# EAGLE design respirho2pile (EAGLE 9.6.2)
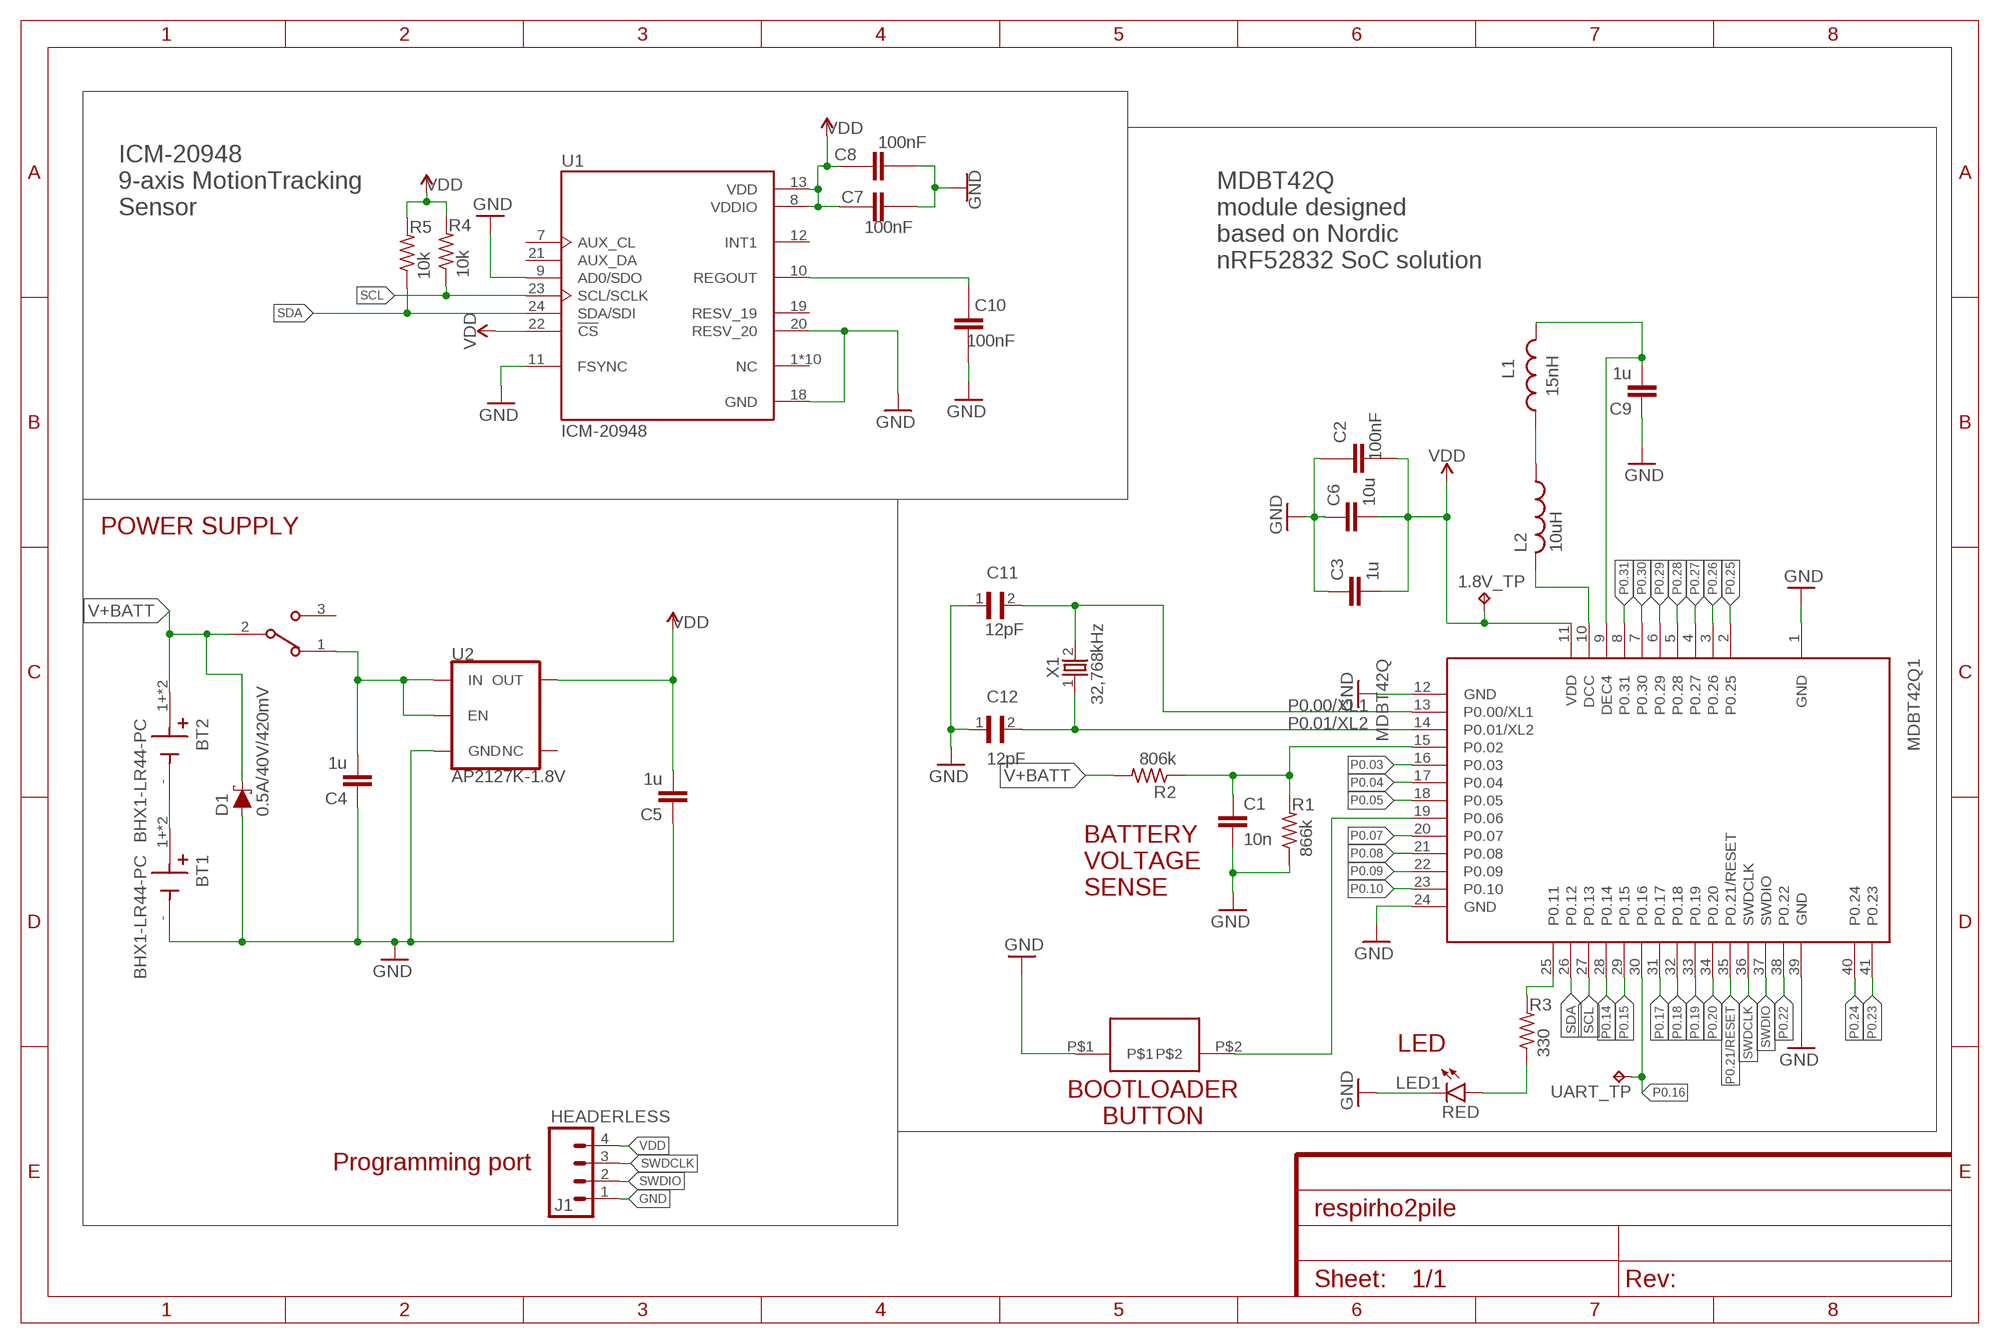
[diagram p0: schematic, sheet 1]

## Parts
1.8V_TP  TPB1,27  [B1,27]
BT1  BHX1-LR44-PC  [BAT_BHX1-LR44-PC]
BT2  BHX1-LR44-PC  [BAT_BHX1-LR44-PC]
C1  10n  C-EUC0603  [C0603]
C2  100nF  CC0402KRX7R6BB104  [CAPC1005X60]
C3  1u  C-EUC0603  [C0603]
C4  1u  C-EUC0603  [C0603]
C5  1u  C-EUC0603  [C0603]
C6  10u  C-EUC2012  [C2012]
C7  100nF  CC0402KRX7R6BB104  [CAPC1005X60]
C8  100nF  CC0402KRX7R6BB104  [CAPC1005X60]
C9  1u  C-EUC0603  [C0603]
C10  100nF  CC0402KRX7R6BB104  [CAPC1005X60]
C11  12pF  04025A120GAT2A  [CAPC1005X56N]
C12  12pF  04025A120GAT2A  [CAPC1005X56N]
D1  0.5A/40V/420mV  DIODE-SCHOTTKY-PMEG4005EJ  [SOD-323]
J1  HEADERLESS  CONN_04PTH  [1X04]
L1  15nH  LQG15HS15NJ02D  [INDC1005X55N]
L2  10uH  INDUCTOR_0603_L  [RESC0603_L]
LED1  RED  LEDCHIPLED_1206  [CHIPLED_1206]
MDBT42Q1  MDBT42Q  [MDBT42Q]
R1  866k  R-US_R0402  [R0402]
R2  806k  R-US_R0402  [R0402]
R3  330  R-US_R0402  [R0402]
R4  10k  R-US_R0402  [R0402]
R5  10k  R-US_R0402  [R0402]
SW1  EG1213  [SW_EG1213]
SW2  KSS231GLFS  [KSS231GLFS]
U1  ICM-20948  [QFN40P300X300X105-24N]
U2  AP2127K-1.8V  TPS7A0518PDBVTK-1.8V  [SOT23-5]
UART_TP  TPB1,27  [B1,27]
X1  32,768kHz  XTAL_32KHZ  [XTAL_3215_N]

## Nets
GND: BT1.- C1.2 C2.2 C3.1 C4.1 C5.1 C6.1 C7.1 C8.1 C9.1 C10.1 C11.1 C12.1 D1.A J1.1 LED1.C MDBT42Q1.1(GND) MDBT42Q1.12(GND) MDBT42Q1.24(GND) MDBT42Q1.39(GND) R1.1 SW2.P$1 U1.9(AD0/SDO) U1.11(FSYNC) U1.18(GND) U1.20(RESV_20) U2.2(GND)
N$1: LED1.A R3.1
N$2: L2.2 MDBT42Q1.10(DCC)
N$3: L1.1 L2.1
N$4: C9.2 L1.2 MDBT42Q1.9(DEC4)
N$5: MDBT42Q1.25(P0.11) R3.2
N$6: BT1.1+(+) BT1.2+(+) BT2.-
N$7: C10.2 U1.10(REGOUT)
N$8: C4.2 SW1.1 U2.1(IN) U2.3(EN)
N$9: C1.1 MDBT42Q1.15(P0.02) R1.2 R2.1
P0.00/XL1: C11.2 MDBT42Q1.13(P0.00/XL1) X1.2
P0.01/XL2: C12.2 MDBT42Q1.14(P0.01/XL2) X1.1
P0.03: MDBT42Q1.16(P0.03)
P0.04: MDBT42Q1.17(P0.04)
P0.05: MDBT42Q1.18(P0.05)
P0.07: MDBT42Q1.20(P0.07)
P0.08: MDBT42Q1.21(P0.08)
P0.09: MDBT42Q1.22(P0.09)
P0.10: MDBT42Q1.23(P0.10)
P0.14: MDBT42Q1.28(P0.14)
P0.15: MDBT42Q1.29(P0.15)
P0.16: MDBT42Q1.30(P0.16) UART_TP.TP
P0.17: MDBT42Q1.31(P0.17)
P0.18: MDBT42Q1.32(P0.18)
P0.19: MDBT42Q1.33(P0.19)
P0.20: MDBT42Q1.34(P0.20)
P0.21/RESET: MDBT42Q1.35(P0.21/RESET)
P0.22: MDBT42Q1.38(P0.22)
P0.23: MDBT42Q1.41(P0.23)
P0.24: MDBT42Q1.40(P0.24)
P0.25: MDBT42Q1.2(P0.25)
P0.26: MDBT42Q1.3(P0.26)
P0.27: MDBT42Q1.4(P0.27)
P0.28: MDBT42Q1.5(P0.28)
P0.29: MDBT42Q1.6(P0.29)
P0.30: MDBT42Q1.7(P0.30)
P0.31: MDBT42Q1.8(P0.31)
P06: MDBT42Q1.19(P0.06) SW2.P$2
SCL: MDBT42Q1.27(P0.13) R4.1 U1.23(SCL/SCLK)
SDA: MDBT42Q1.26(P0.12) R5.1 U1.24(SDA/SDI)
SWDCLK: J1.3 MDBT42Q1.36(SWDCLK)
SWDIO: J1.2 MDBT42Q1.37(SWDIO)
V+BATT: BT2.1+(+) BT2.2+(+) D1.C R2.2 SW1.2
VDD: 1.8V_TP.TP C2.1 C3.2 C5.2 C6.2 C7.2 C8.2 J1.4 MDBT42Q1.11(VDD) R4.2 R5.2 U1.8(VDDIO) U1.13(VDD) U1.22(!CS) U2.5(OUT)
Unconnected: SW1.3 U1.1(NC) U1.2(NC) U1.3(NC) U1.4(NC) U1.5(NC) U1.6(NC) U1.7(AUX_CL) U1.12(INT1) U1.14(NC) U1.15(NC) U1.16(NC) U1.17(NC) U1.19(RESV_19) U1.21(AUX_DA) U2.4(NC)

## Notes on the sheet
- ICM-20948
  9-axis MotionTracking
  Sensor
- MDBT42Q
  module designed 
  based on Nordic 
  nRF52832 SoC solution
- POWER SUPPLY
- BATTERY
  VOLTAGE
  SENSE
- LED
- BOOTLOADER
  BUTTON
- Programming port

## Library data of the parts
1.8V_TP UART_TP = testpad:TP: Test pad
BT1 BT2 = BHX1-LR44-PC:BHX1-LR44-PC: Battery Retainer Coin, 12.0mm 1 Cell PC Pin; DESCRIPTION: Battery Retainer Coin, 12.0mm 1 Cell PC Pin; DIGI-KEY_PART_NUMBER: BHX1-LR44-PC-G-ND; MF: MPD; MP: BHX1-LR44-PC; PACKAGE: None; PURCHASE-URL: https://pricing.snapeda.com/search/part/BHX1-LR44-PC/?ref=eda
C1 C3-C6 C9 = rcl:C-EU: CAPACITOR, European symbol; SPICEPREFIX: C
C2 C7 C8 C10 = CC0402KRX7R6BB104:CC0402KRX7R6BB104: Capacitor 100nF 10V 0402 SMD X7R (reel); DESCRIPTION: 0.1µF ±10% 10V Ceramic Capacitor X7R 0402 _1005 Metric_; DIGI-KEY_PART_NUMBER: 311-1345-1-ND; DIGI-KEY_PURCHASE_URL: https://www.digikey.com/product-detail/en/yageo/CC0402KRX7R6BB104/311-1345-1-ND/2103129?utm_source=snapeda&utm_medium=aggregator&utm_campaign=symbol; MF: Yageo; MP: CC0402KRX7R6BB104; PACKAGE: 0402 Yageo
C11 C12 = 04025A120GAT2A:04025A120GAT2A: CAP, MLCC, C0G, 12PF, 50V, 0402; DESCRIPTION: 0402 12 pF 50 V ±2% Tolerance C0G/NP0 SMT Multilayer Ceramic Capacitor; DIGI-KEY_PART_NUMBER: 478-7871-1-ND; DIGI-KEY_PURCHASE_URL: https://www.digikey.com/product-detail/en/avx-corporation/04025A120GAT2A/478-7871-1-ND/3881494?utm_source=snapeda&utm_medium=aggregator&utm_campaign=symbol; MF: AVX; MP: 04025A120GAT2A; PACKAGE: 1005 AVX
D1 = SparkFun-DiscreteSemi:DIODE-SCHOTTKY: Schottky diode A Schottky diode is a semiconductor diode which has a low forward voltage drop and a very fast switching action.; PROD_ID: DIO-10955
J1 = SparkFun-Connectors:CONN_04: Multi connection point. Often used as Generic Header-pin footprint for 0.1 inch spaced/style header connections On any of the 0.1 inch spaced packages, you can populate with these: Break Away Headers - Straight <https://www.sparkfun.com/products/116> (PRT-00116) Break Away Male Headers - Right Angle <https://www.sparkfun.com/products/553> (PRT-00553) Female Headers <https://www.sparkfun.com/products/115> (PRT-00115) Break Away Headers - Machine Pin <https://www.sparkfun.com/products/117> (PRT-00117) Break Away Female Headers - Swiss Machine Pin <https://www.sparkfun.com/products/743> (PRT-00743) For SCREWTERMINALS and SPRING TERMINALS visit here: Screw Terimnals on SparkFun.com <https://www.sparkfun.com/search/results?term=Screw+Terminals> (5mm/3.5mm/2.54mm spacing) This device is also useful as a general connection point to wire up your design to another part of your project. Our various solder wires solder well into these plated through hole pads. Hook-Up Wire - Assortment (Stranded, 22 AWG) <https://www.sparkfun.com/products/11375> (PRT-11375) Hook-Up Wire - Assortment (Solid Core, 22 AWG) <https://www.sparkfun.com/products/11367> (PRT-11367) View the entire wire category on our website here <https://www.sparkfun.com/categories/141> Special notes: Molex polarized connector foot print use with SKU : PRT-08231 with associated crimp pins and housings. 1MM SMD Version SKU: PRT-10208; PROD_ID: CONN-09696
L1 = LQG15HS15NJ02D:LQG15HS15NJ02D: Ind RF Chip Multi-Layer 15nH 5% 100MHz 8Q-Factor Air 300mA 0402 Paper T/R; DESCRIPTION: Inductor with Inductance: 15nH Tol. +/-5%, Package: 0402 _1005_; DIGI-KEY_PART_NUMBER: 490-2625-1-ND; DIGI-KEY_PURCHASE_URL: https://www.digikey.com/product-detail/en/murata-electronics/LQG15HS15NJ02D/490-2625-1-ND/662905?utm_source=snapeda&utm_medium=aggregator&utm_campaign=symbol; MF: Murata Electronics; MP: LQG15HS15NJ02D; PACKAGE: 1005 Murata
L2 = Nordic_nRF:INDUCTOR: Generic chip inductor
LED1 = led:LED: LED OSRAM: - CHIPLED LG R971, LG N971, LY N971, LG Q971, LY Q971, LO R971, LY R971 LH N974, LH R974 LS Q976, LO Q976, LY Q976 LO Q996 - Hyper CHIPLED LW Q18S LB Q993, LB Q99A, LB R99A - SideLED LS A670, LO A670, LY A670, LG A670, LP A670 LB A673, LV A673, LT A673, LW A673 LH A674 LY A675 LS A676, LA A676, LO A676, LY A676, LW A676 LS A679, LY A679, LG A679 - Hyper Micro SIDELED® LS Y876, LA Y876, LO Y876, LY Y876 LT Y87S - SmartLED LW L88C, LW L88S LB L89C, LB L89S, LG L890 LS L89K, LO L89K, LY L89K LS L896, LA L896, LO L896, LY L896 - TOPLED LS T670, LO T670, LY T670, LG T670, LP T670 LSG T670, LSP T670, LSY T670, LOP T670, LYG T670 LG T671, LOG T671, LSG T671 LB T673, LV T673, LT T673, LW T673 LH T674 LS T676, LA T676, LO T676, LY T676, LB T676, LH T676, LSB T676, LW T676 LB T67C, LV T67C, LT T67C, LS T67K, LO T67K, LY T67K, LW E67C LS E67B, LA E67B, LO E67B, LY E67B, LB E67C, LV E67C, LT E67C LW T67C LS T679, LY T679, LG T679 LS T770, LO T770, LY T770, LG T770, LP T770 LB T773, LV T773, LT T773, LW T773 LH T774 LS E675, LA E675, LY E675, LS T675 LS T776, LA T776, LO T776, LY T776, LB T776 LHGB T686 LT T68C, LB T68C - Hyper Mini TOPLED® LB M676 - Mini TOPLED Santana® LG M470 LS M47K, LO M47K, LY M47K Source: http://www.osram.convergy.de LUXEON: - LUMILED® LXK2-PW12-R00, LXK2-PW12-S00, LXK2-PW14-U00, LXK2-PW14-V00 LXK2-PM12-R00, LXK2-PM12-S00, LXK2-PM14-U00 LXK2-PE12-Q00, LXK2-PE12-R00, LXK2-PE12-S00, LXK2-PE14-T00, LXK2-PE14-U00 LXK2-PB12-K00, LXK2-PB12-L00, LXK2-PB12-M00, LXK2-PB14-N00, LXK2-PB14-P00, LXK2-PB14-Q00 LXK2-PR12-L00, LXK2-PR12-M00, LXK2-PR14-Q00, LXK2-PR14-R00 LXK2-PD12-Q00, LXK2-PD12-R00, LXK2-PD12-S00 LXK2-PH12-R00, LXK2-PH12-S00 LXK2-PL12-P00, LXK2-PL12-Q00, LXK2-PL12-R00 Source: www.luxeon.com KINGBRIGHT: KA-3528ASYC Source: www.kingbright.com
MDBT42Q1 = MDBT42Q_171016:MDBT42Q: Raytac Corporation MDBT42Q-512K, MDBT42Q-P512K Bluetooth Low Energy Module based on Noridc nRF52832 Source: Raytac datasheet
R1-R5 = rcl:R-US_: RESISTOR, American symbol; SPICEPREFIX: R
SW1 = Slide_switch:EG1213: EG Series SPDT On-On Right Angle Through Hole Slide Switch; DESCRIPTION: Slide Switch SPDT Through Hole, Right Angle; DIGI-KEY_PART_NUMBER: EG1906-ND; MF: E-Switch; MP: EG1213; PACKAGE: None; PURCHASE-URL: https://pricing.snapeda.com/search/part/EG1213/?ref=eda
SW2 = KSS231GLFS:KSS231GLFS
U1 = ICM-20948:ICM-20948: Accelerometer, Gyroscope, Magnetometer, 9 Axis Sensor I²C, SPI Output Check prices <https://pricing.snapeda.com/parts/ICM-20948/TDK%20InvenSense/view-part?ref=eda>; AVAILABILITY: Good; DESCRIPTION: Accelerometer, Gyroscope, Magnetometer, 9 Axis Sensor I²C, SPI Output; MF: TDK InvenSense; MP: ICM-20948; PACKAGE: TFQFN-24 TDK InvenSense; PRICE: None; PURCHASE-URL: https://pricing.snapeda.com/search/part/ICM-20948/?ref=eda
U2 = TPS7A05:TPS7A0518PDBVT: TPS7A0518PDBVT https://www.digikey.it/product-detail/en/texas-instruments/TPS7A0518PDBVT/296-50251-1-ND/9597140; PROD_ID: VREG-14239
X1 = XTAL:XTAL_32KHZ

## Board
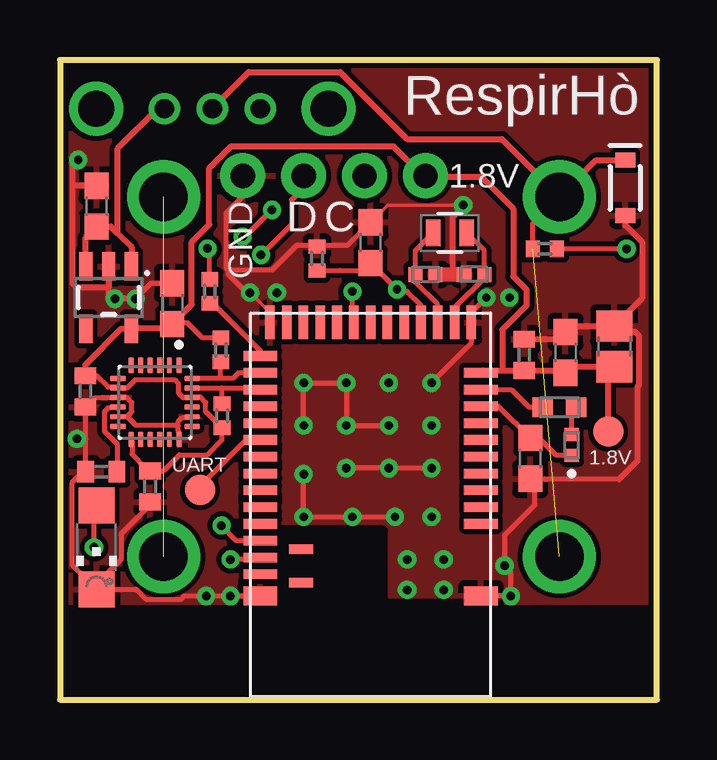
[diagram p1: board, top side]
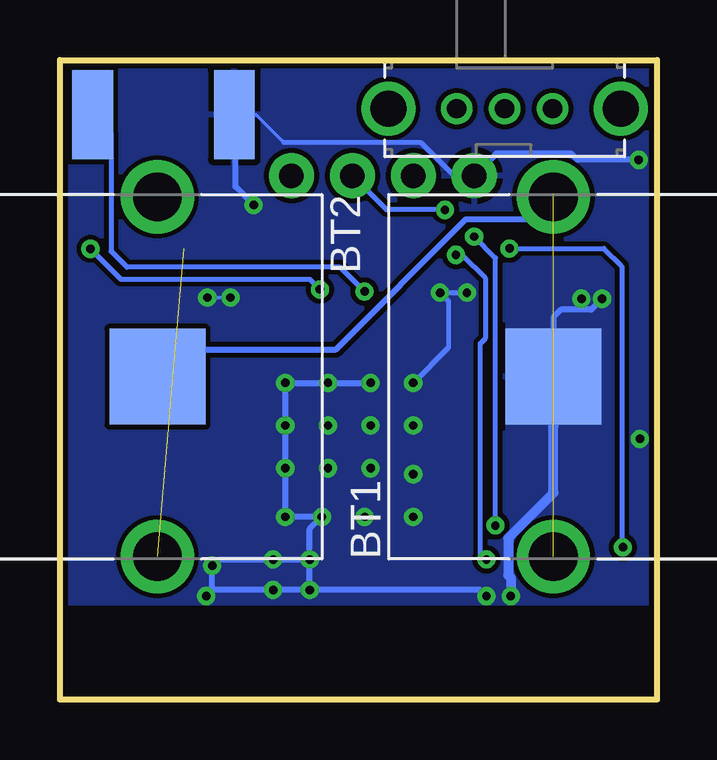
[diagram p2: board, bottom side, seen from below]

Size 24.89 x 26.67 mm. Coordinates in mm from the lower left corner, seen from the top.
Outline: 0,26.67 0,0 24.89,0 24.89,26.67 0,26.67
Copper layers (1*16): Top 0.035mm / dielectric 1.5mm / Bottom 0.035mm
Design rules "mdsrl *": minimum track width 6mil, minimum drill 0.2mm, track to track 6mil, track to pad 6mil, pad to pad 6mil, via to via 6mil, smd to smd 6mil, copper to edge 8mil, drill to drill 6mil, minimum pad ring 10mil, minimum via ring 8mil, stop-mask expansion 10mil, vias tented up to drill 14mil, thermal gap 10mil

### Footprints (pad centres in the part's own frame; a part is rotated, then mirrored left to right if it is on the bottom)
B1,27 = smd 1.27 x 1.27: TP 0,0
BAT_BHX1-LR44-PC = drill 2.03: 1+ -7.5,0; 2+ 7.5,0 | smd 4 x 4: - 0,0
C0603 = smd 1.1 x 1: 1 -0.85,0; 2 0.85,0
CAPC1005X60 = smd 0.7 x 0.9: 1 -0.65,0; 2 0.65,0
C2012 = smd 1.3 x 1.5: 1 -0.85,0; 2 0.85,0
CAPC1005X56N = smd 0.59 x 0.63: 1 -0.42,0; 2 0.42,0
SOD-323 = smd 0.63 x 0.83: A 1.15,0; C -1.15,0
1X04 = drill 1.016 pad 1.88: 1 0,0; 2 2.54,0; 3 5.08,0; 4 7.62,0
INDC1005X55N = smd 0.54 x 0.6: 1 -0.432,0; 2 0.432,0
RESC0603_L = smd 0.85 x 0.8: 1 -0.7,0; 2 0.7,0
CHIPLED_1206 = smd 1.5 x 1.5: A 0,-1.75; C 0,1.75
MDBT42Q = smd 1.4 x 0.8: 1 -4.6,3.8; 39 4.6,3.8 | smd 1.4 x 0.4: 2 -4.6,0.8; 3 -4.6,0.1; 4 -4.6,-0.6; 5 -4.6,-1.3; 6 -4.6,-2; 7 -4.6,-2.7; 8 -4.6,-3.4; 9 -4.6,-4.1; 10 -4.6,-4.8; 11 -4.6,-5.5; 25 4.6,-6.2; 26 4.6,-5.5; 27 4.6,-4.8; 28 4.6,-4.1; 29 4.6,-3.4; 30 4.6,-2.7; 31 4.6,-2; 32 4.6,-1.3; 33 4.6,-0.6; 34 4.6,0.1; 35 4.6,0.8; 36 4.6,1.5; 37 4.6,2.2; 38 4.6,2.9 | smd 0.4 x 1.4: 12 -4.2,-7.6; 13 -3.5,-7.6; 14 -2.8,-7.6; 15 -2.1,-7.6; 16 -1.4,-7.6; 17 -0.7,-7.6; 18 0,-7.6; 19 0.7,-7.6; 20 1.4,-7.6; 21 2.1,-7.6; 22 2.8,-7.6; 23 3.5,-7.6; 24 4.2,-7.6 | smd 1 x 0.4: 40 2.9,3.25; 41 2.9,1.85
R0402 = smd 0.6 x 0.7: 1 -0.5,0; 2 0.5,0
SW_EG1213 = drill 0.8: 1 -2,0; 2 0,0; 3 2,0 | drill 1.5: P$4 -4.85,0; P$5 4.85,0
KSS231GLFS = smd 1.7 x 3.7: P$1 -2.95,0; P$2 2.95,0
QFN40P300X300X105-24N = smd 0.64 x 0.22: 1 -1.545,1; 2 -1.545,0.6; 3 -1.545,0.2; 4 -1.545,-0.2; 5 -1.545,-0.6; 6 -1.545,-1; 13 1.545,-1; 14 1.545,-0.6; 15 1.545,-0.2; 16 1.545,0.2; 17 1.545,0.6; 18 1.545,1 | smd 0.22 x 0.64: 7 -1,-1.545; 8 -0.6,-1.545; 9 -0.2,-1.545; 10 0.2,-1.545; 11 0.6,-1.545; 12 1,-1.545; 19 1,1.545; 20 0.6,1.545; 21 0.2,1.545; 22 -0.2,1.545; 23 -0.6,1.545; 24 -1,1.545
SOT23-5 = smd 0.55 x 1.2: 1 -0.95,-1.3; 2 0,-1.3; 3 0.95,-1.3; 4 0.95,1.3; 5 -0.95,1.3
XTAL_3215_N = smd 0.6 x 1.1: 1 -0.7,0; 2 0.7,0

### Placement (x,y rotation side)
1.8V_TP  22.86,11.18 0 top
BT1  4.32,13.46 90 bottom
BT2  20.83,13.46 270 bottom
C1  12.95,19.05 90 top
C2  19.35,14.38 90 top
C3  21.08,14.48 270 top
C4  1.52,20.57 270 top
C5  4.67,16.51 270 top
C6  23.11,14.73 270 top
C7  1.07,12.85 90 top
C8  3.76,8.89 90 top
C9  19.61,10.06 90 top
C10  1.73,9.5 0 top
C11  17.27,17.73 0 top
C12  15.24,17.73 180 top
D1  23.57,21.34 270 top
J1  7.62,21.84 0 top
L1  21.34,10.62 270 top
L2  20.83,12.19 180 top
LED1  1.52,6.35 180 top
MDBT42Q1  12.95,8.13 180 top
R1  10.72,18.39 270 top
R2  20.22,18.8 180 top
R3  6.25,17.02 270 top
R4  6.76,11.84 270 top
R5  6.71,14.58 90 top
SW1  6.35,24.64 180 bottom
SW2  20.57,24.38 180 bottom
U1  3.96,12.4 270 top
U2  2.03,16.76 180 top
UART_TP  5.84,8.74 0 top
X1  16.26,19.46 0 top

### Tracks (layer width: path | path; a pad name or v marks a point on that pad's centre or on a via)
GND  (via drill 0.35)
  Top 0.152: MDBT42Q1.24 8.75,16.14 v7.93,16.97 | C1.2 13.68,20.62 v16.81,20.62
  Top 0.2: v7.93,16.97 7.77,16.97 7,17.74 7,17.91 8.85,17.91 9.89,18.95 | 2.8,7.16 2.54,6.9 2.54,5.85 1.41,4.71 | LED1.C 3.17,4.6 3.58,4.19 5.05,4.19 5.18,4.32 v6.1,4.32 v7.11,4.32 v7.12,4.33 MDBT42Q1.39 | MDBT42Q1.1 17.56,4.32 v18.8,4.32 18.8,5.33 v18.54,5.59 18.54,6.86 19.81,8.13 | v17.78,16.76 17.15,16.14 MDBT42Q1.12 17.15,14.87 v15.49,13.21 | v13.97,7.62 v12.19,7.62 v10.16,7.62 v10.16,9.4 | v15.49,9.65 v13.72,9.65 v11.94,9.65 | v10.16,11.43 v10.16,13.21 v11.94,13.21 v11.94,11.43 v13.72,11.43 | 12.01,18.95 C1.2 | U1.11 2.43,11.8 2.8,11.8 | 2.8,11.8 2.99,12 2.99,12.39 2.77,12.61 2.43,12.61 U1.9 1.46,12.6 C7.1 1.08,12.19 1.08,10.87 | U1.18 4.96,11.17 4.93,11.2 4.93,11.43 | 4.93,11.43 4.93,11.59 5.1,11.76 5.47,11.76 | 2.8,11.8 3.09,11.51 3.09,11.5 3.15,11.45 4.92,11.45 4.93,11.43 | 1.08,10.87 C10.1 0.96,9.5 0.52,9.07 | v0.71,10.87 1.08,10.87
  Top 0.203: LED1.C 1.41,4.71 0.52,5.6 0.52,9.07 | 9.89,18.95 10.66,18.95 R1.1 10.78,18.95 12.01,18.95 | 19.81,8.13 19.81,9.01 C9.1 23.3,9.21 23.32,9.2 | v3.15,16.71 3.8,17.36 C5.1 | J1.1 7.62,20.98 6.91,20.27 6.91,18 7,17.91 | 5.47,11.76 U1.20 | 2.8,7.16 3.76,8.12 C8.1
  Top 0.254: C6.1 21.34,15.58 C3.1 20.78,15.03 C2.2 | 2.03,17.18 0.69,17.18 0.53,17.35 0.53,21.44 | 2.03,17.18 2.03,16.76 2.08,16.71 v2.29,16.71 v3.15,16.71 | U2.2 2.03,17.18 | C6.1 23.35,15.34 23.98,15.34 24.14,15.18 24.14,13.12 24.08,13.05 24.08,9.96 23.32,9.2 | v16.81,20.62 16.81,20.56 16.38,20.12 16.38,17.85 16.26,17.73 | D1.A 23.57,19.78 24.28,19.07 24.28,16.75 C6.1 | 0.53,21.44 0.53,22.27 v0.76,22.5 | C4.1 0.54,21.42 0.53,21.44
  Top 0.61: C12.1 16.26,17.73 C11.1
  Bottom 0.152: 4.32,11.43 BT1.- | 16.99,24.66 17.27,24.38 SW2.P$1 16.71,24.38 15.57,23.24 | v17.78,16.76 v18.74,16.76
  Bottom 0.2: J1.1 8.47,21.84 9.87,23.24 15.57,23.24 | v7.93,16.97 v9.04,16.97 8.69,16.61 8.69,14.68 v10.16,13.21
  Bottom 0.254: v7.11,4.32 7.37,4.57 v16,4.57 18.54,4.57 | v14.48,4.57 v14.48,5.84 | v18.8,4.32 18.54,4.57 | 18.54,4.57 v18.54,5.59 18.29,5.84 v16,5.84 v14.48,5.84 | v14.48,5.84 14.48,7.11 v13.97,7.62 v15.49,7.62 v15.49,9.65 v15.49,11.43 v15.49,13.21 v13.72,13.21 v11.94,13.21 | v16.81,20.62 17.58,21.39 17.58,24.08 16.99,24.66 | v0.76,22.5 3.31,22.5 3.57,22.76 6.7,22.76 J1.1 | v2.29,16.71 2.74,16.26 4.01,16.26 4.32,15.95 BT1.-
  Bottom 0.406: 4.32,11.43 4.32,8.62 6.2,6.74 6.2,5.18 6.1,5.08 v6.1,4.32
  pour Bottom (isolate 0.203): 0.25,26.42 24.64,26.42 24.64,4.06 0.25,4.06
  pour Top (isolate 0.203): 0.25,26.42 24.64,26.42 24.64,4.06 13.72,4.06 13.72,7.37 8.89,7.37 8.89,4.06 0.25,4.06
  pour Bottom (no thermals): 1.93,16.26 1.93,10.97 6.25,10.97 6.25,16.26
N$1  (via drill 0.35)
  Top 0.203: v1.42,6.35 1.42,8 LED1.A | R3.1 6.25,18.71 v6.15,18.81
  Bottom 0.203: v6.15,18.81 2.21,18.81 1.47,18.07 1.47,6.4 v1.42,6.35
N$2
  Top 0.203: MDBT42Q1.10 18.82,12.93 19.56,12.19 L2.2
N$3
  Top 0.203: L1.1 21.34,12 L2.1
N$4
  Top 0.203: L1.2 20.7,10.19 19.98,10.91 C9.2 18.29,12.23 MDBT42Q1.9
N$5
  Top 0.203: MDBT42Q1.25 8.35,14.56 6.39,16.52 R3.2
N$6  (1 unrouted)
  Bottom 0.254: BT2.- 19.71,14.58 13.41,14.58 7.98,20.02 4.32,20.02 BT1.2+
N$7
  Top 0.2: U1.10 2.38,12.16 2.01,12.16 1.84,11.99 1.84,11.2 2.38,10.67 C10.2
N$8
  Top 0.254: 2.41,19.43 2.98,18.86 U2.1 | 2.41,19.43 2.41,22.99 4.06,24.64 SW1.1 | U2.3 1.08,19.28 C4.2 2.12,19.72 2.41,19.43
N$9  (via drill 0.35)
  Top 0.203: MDBT42Q1.15 15.05,16.44 14.48,17.02 14.14,17.02 v14.05,17.1 C1.1 12.64,17.88 11.68,17.88 11.68,17.89 R1.2 | R2.1 v23.62,18.8
  Bottom 0.203: v23.62,18.8 22.35,17.53 14.48,17.53 v14.05,17.1
P0.00/XL1
  Top 0.203: MDBT42Q1.13 16.45,16.34 17.69,17.58 C11.2 17.69,18.72 X1.2
P0.01/XL2
  Top 0.203: MDBT42Q1.14 15.75,16.46 14.82,17.4 C12.2 14.82,18.72 X1.1
P0.16
  Top 0.2: UART_TP.TP 5.84,8.9 7.77,10.83 MDBT42Q1.30
P06  (via drill 0.35)
  Top 0.203: MDBT42Q1.19 12.19,15.79 v12.19,17.02
  Bottom 0.203: v12.19,17.02 13.21,18.03 22.1,18.03 22.76,18.7 22.76,23.62 SW2.P$2
SCL
  Top 0.203: U1.23 6.76,13 | 6.76,13 7.83,13 7.9,12.93 MDBT42Q1.27 | R4.1 6.76,13
SDA
  Top 0.203: MDBT42Q1.26 7.45,13.63 7.21,13.39 6.66,13.39 | 6.66,13.39 U1.24 | 6.66,13.39 6.71,13.45 R5.1
SWDCLK  (via drill 0.35)
  Top 0.203: MDBT42Q1.36 7.36,6.63 v6.73,7.26 | v8.84,20.42 7.72,19.3 v7.62,19.3
  Bottom 0.203: v6.73,7.26 6.73,18.42 v7.62,19.3 | v8.84,20.42 11.28,20.42 J1.3
SWDIO  (via drill 0.35)
  Top 0.203: MDBT42Q1.37 8.27,5.84 v7.11,5.84 | v8.38,18.54 9.65,19.81 9.65,20.83 10.16,21.34 J1.2
  Bottom 0.203: v7.11,5.84 7.37,6.1 7.37,14.85 7.14,15.08 7.14,17.55 8.13,18.54 v8.38,18.54
V+BATT  (1 unrouted)
  Top 0.203: 19.98,20.11 BT2.1+ 19.72,19.85 R2.2
  Top 0.254: SW1.2 7.87,26.16 11.68,26.16 14.48,23.37 18.42,23.37 BT2.1+ 22.35,22.49 D1.C
VDD
  Top 0.2: U1.13 3,10.81 3,10.24 3.56,9.68 3.76,9.68 | C7.2 1.54,13.5 2.01,13.03 2.38,13.03 U1.8 2.8,13 3.15,13.35 4.77,13.35 4.93,13.18 4.93,12.8 5.15,12.58 5.49,12.58 U1.22 5.52,12.61 5.87,12.61 6.08,12.39 6.08,12.01 6.3,11.78 6.31,11.78 R4.2 6.76,10.82 6.15,10.21 4.99,10.21 4.32,9.54 C8.2
  Top 0.203: 21.03,13.57 C3.2 | R5.2 5.95,15.08 5.33,15.7 4.72,15.7 | 3.76,9.68 C8.2
  Top 0.254: C3.2 21.34,13.88 C6.2 22.86,13.63 1.8V_TP.TP | MDBT42Q1.11 17.65,13.73 18.44,13.73 | 18.44,13.73 C2.1 20.88,13.73 21.03,13.57 | 18.44,13.73 18.44,15.43 19.45,16.44 19.45,17.09 18.9,17.64 18.9,20.47 17.56,21.8 15.28,21.8 J1.4 15.14,21.84 13.92,23.06 7.12,23.06 6.22,22.17 6.22,19.81 5.49,19.08 5.49,16.48 4.72,15.7 C5.2 4.51,15.49 2.98,15.49 U2.5 2.56,15.46 1.07,13.97 C7.2

### Text on the board
tPlace: RespirHò | 1.8V | GND | D | C | 1.8V | UART